# Altium schematic sheet view.SchDoc
size A4
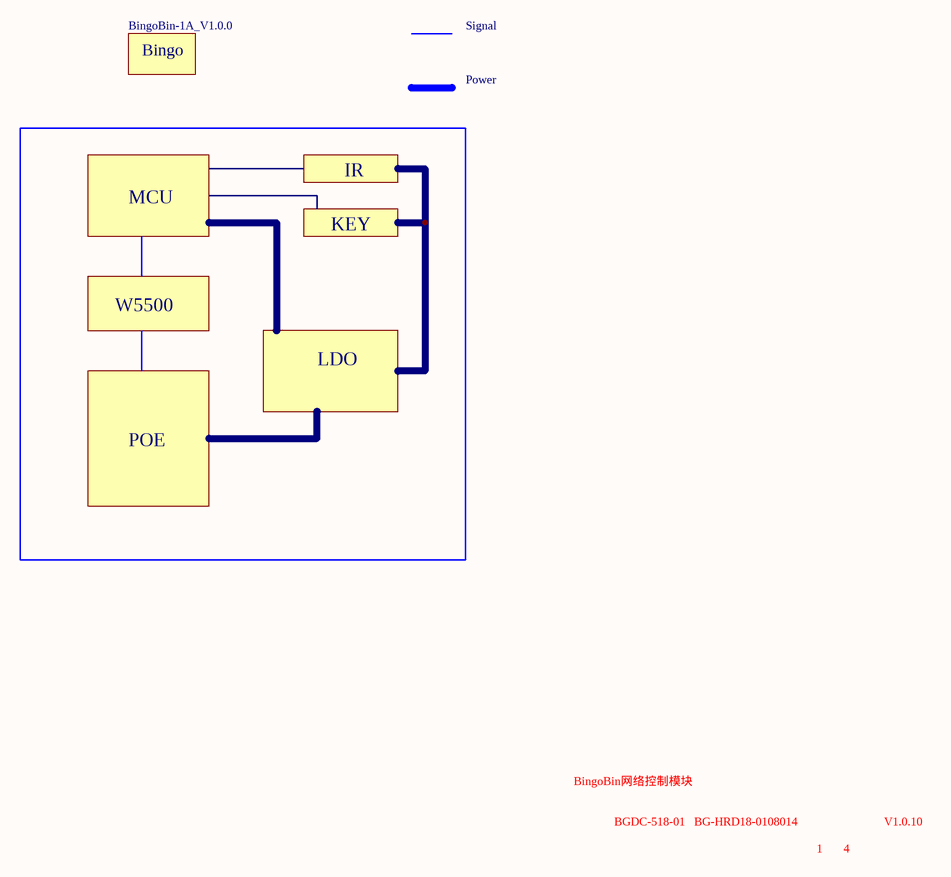
[diagram p0: view.SchDoc]

## Parts
BingoBin-1A_V1.0.0  BingoBin_V1.0.10  [bingo_logo]  (value not drawn)

## Notes on the sheet
- Signal
- Power
- IR
- MCU
- KEY
- W5500
- LDO
- POE
- BingoBin网络控制模块
- BGDC-518-01   BG-HRD18-0108014
- 1
- 4
- V1.0.10
- (in symbol bingo_logo) Bingo

## Library data of the parts
BingoBin-1A_V1.0.0 = bingo_logo: bingo logo; value: BingoBin_V1.0.10